# EAGLE design untitled (EAGLE 7.5.0)
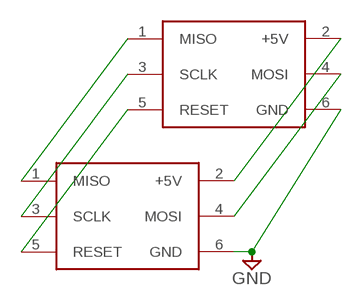
[diagram p0: schematic, sheet 1]

## Parts
U$1  ICSP  [ICSP]
U$2  ICSP_SPRING  [ICSP_SPRING]

## Nets
GND: U$1.6(GND) U$2.6(GND)
N$1: U$1.3(SCLK) U$2.3(SCLK)
N$2: U$1.5(RESET) U$2.5(RESET)
N$3: U$1.1(MISO) U$2.1(MISO)
N$4: U$1.2(+5V) U$2.2(+5V)
N$5: U$1.4(MOSI) U$2.4(MOSI)

## Library data of the parts
U$1 = 08_CONECTOR:ICSP
U$2 = 08_CONECTOR:ICSP_SPRING

## Board
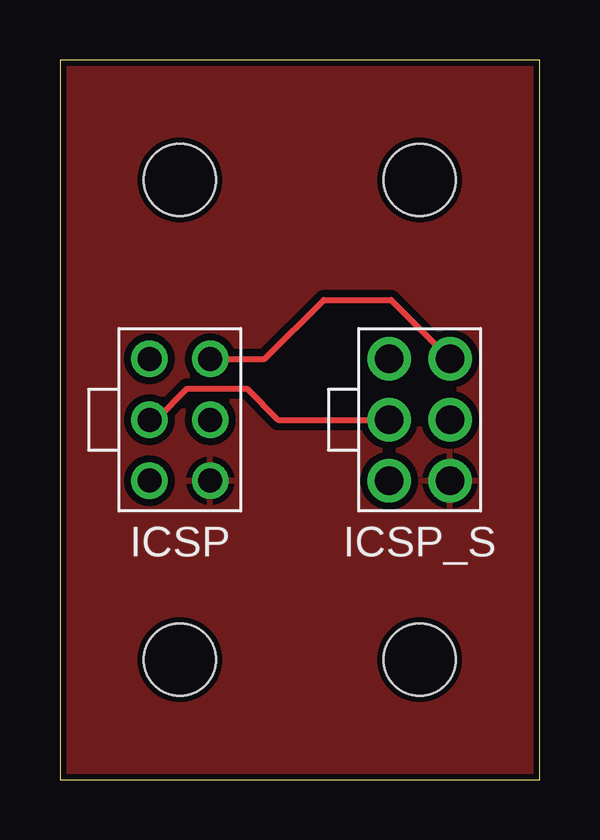
[diagram p1: board, top side]
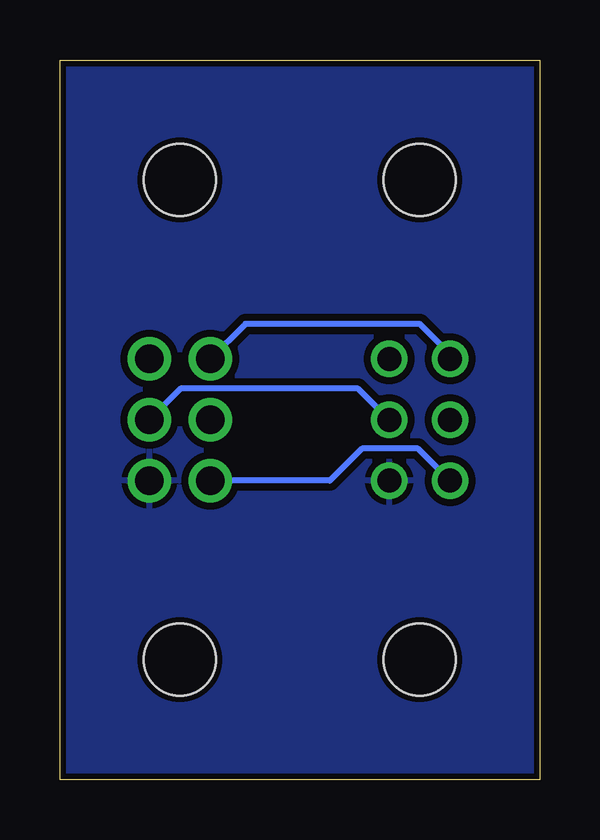
[diagram p2: board, bottom side, seen from below]

Size 20 x 30 mm. Coordinates in mm from the lower left corner, seen from the top.
Outline: 0,0 20,0 20,30 0,30 0,0
Copper layers (1*16): Top 0.035mm / dielectric 1.5mm / Bottom 0.035mm
Design rules "LPKF": minimum track width 6mil, minimum drill 12mil, track to track 0.3mm, track to pad 0.3mm, pad to pad 0.3mm, via to via 0.3mm, smd to smd 0mil, copper to edge 10mil, drill to drill 0.4mm, minimum pad ring 10mil, minimum via ring 6mil, stop-mask expansion 2mil, vias tented up to drill 100mil, thermal gap 10mil
Holes 3 mm at 5,5 5,25 15,25 15,5

### Footprints (pad centres in the part's own frame; a part is rotated, then mirrored left to right if it is on the bottom)
ICSP = drill 1 pad 1.5: 1 -1.27,2.54; 2 1.27,2.54; 3 -1.27,0; 4 1.27,0; 5 -1.27,-2.54; 6 1.27,-2.54
ICSP_SPRING = drill 1.2: 1 -1.27,2.54; 2 1.27,2.54; 3 -1.27,0; 4 1.27,0; 5 -1.27,-2.54; 6 1.27,-2.54

### Placement (x,y rotation side)
U$1  5,15 0 top
U$2  15,15 0 top

### Tracks (layer width: path | path; a pad name or v marks a point on that pad's centre or on a via)
GND
  pour Bottom: 0,0 20,0 20,30 0,30
  pour Top: 0,30 20,30 20,0 0,0
N$1
  Top 0.25: U$1.3 4,15 5.3,16.3 7.8,16.3 9.1,15 U$2.3
N$2
  Bottom 0.25: U$1.5 5.07,13.8 7.4,13.8 8.74,12.46 U$2.5
N$3
  Bottom 0.25: U$1.1 3.73,17.73 5,19 12.27,19 U$2.1
N$4
  Top 0.25: U$1.2 8.54,17.54 11,20 13.81,20 U$2.2
N$5
  Bottom 0.25: U$1.4 7.57,16.3 14.97,16.3 U$2.4